# EAGLE design Ethernet Shield v2.0 (EAGLE 6.1)
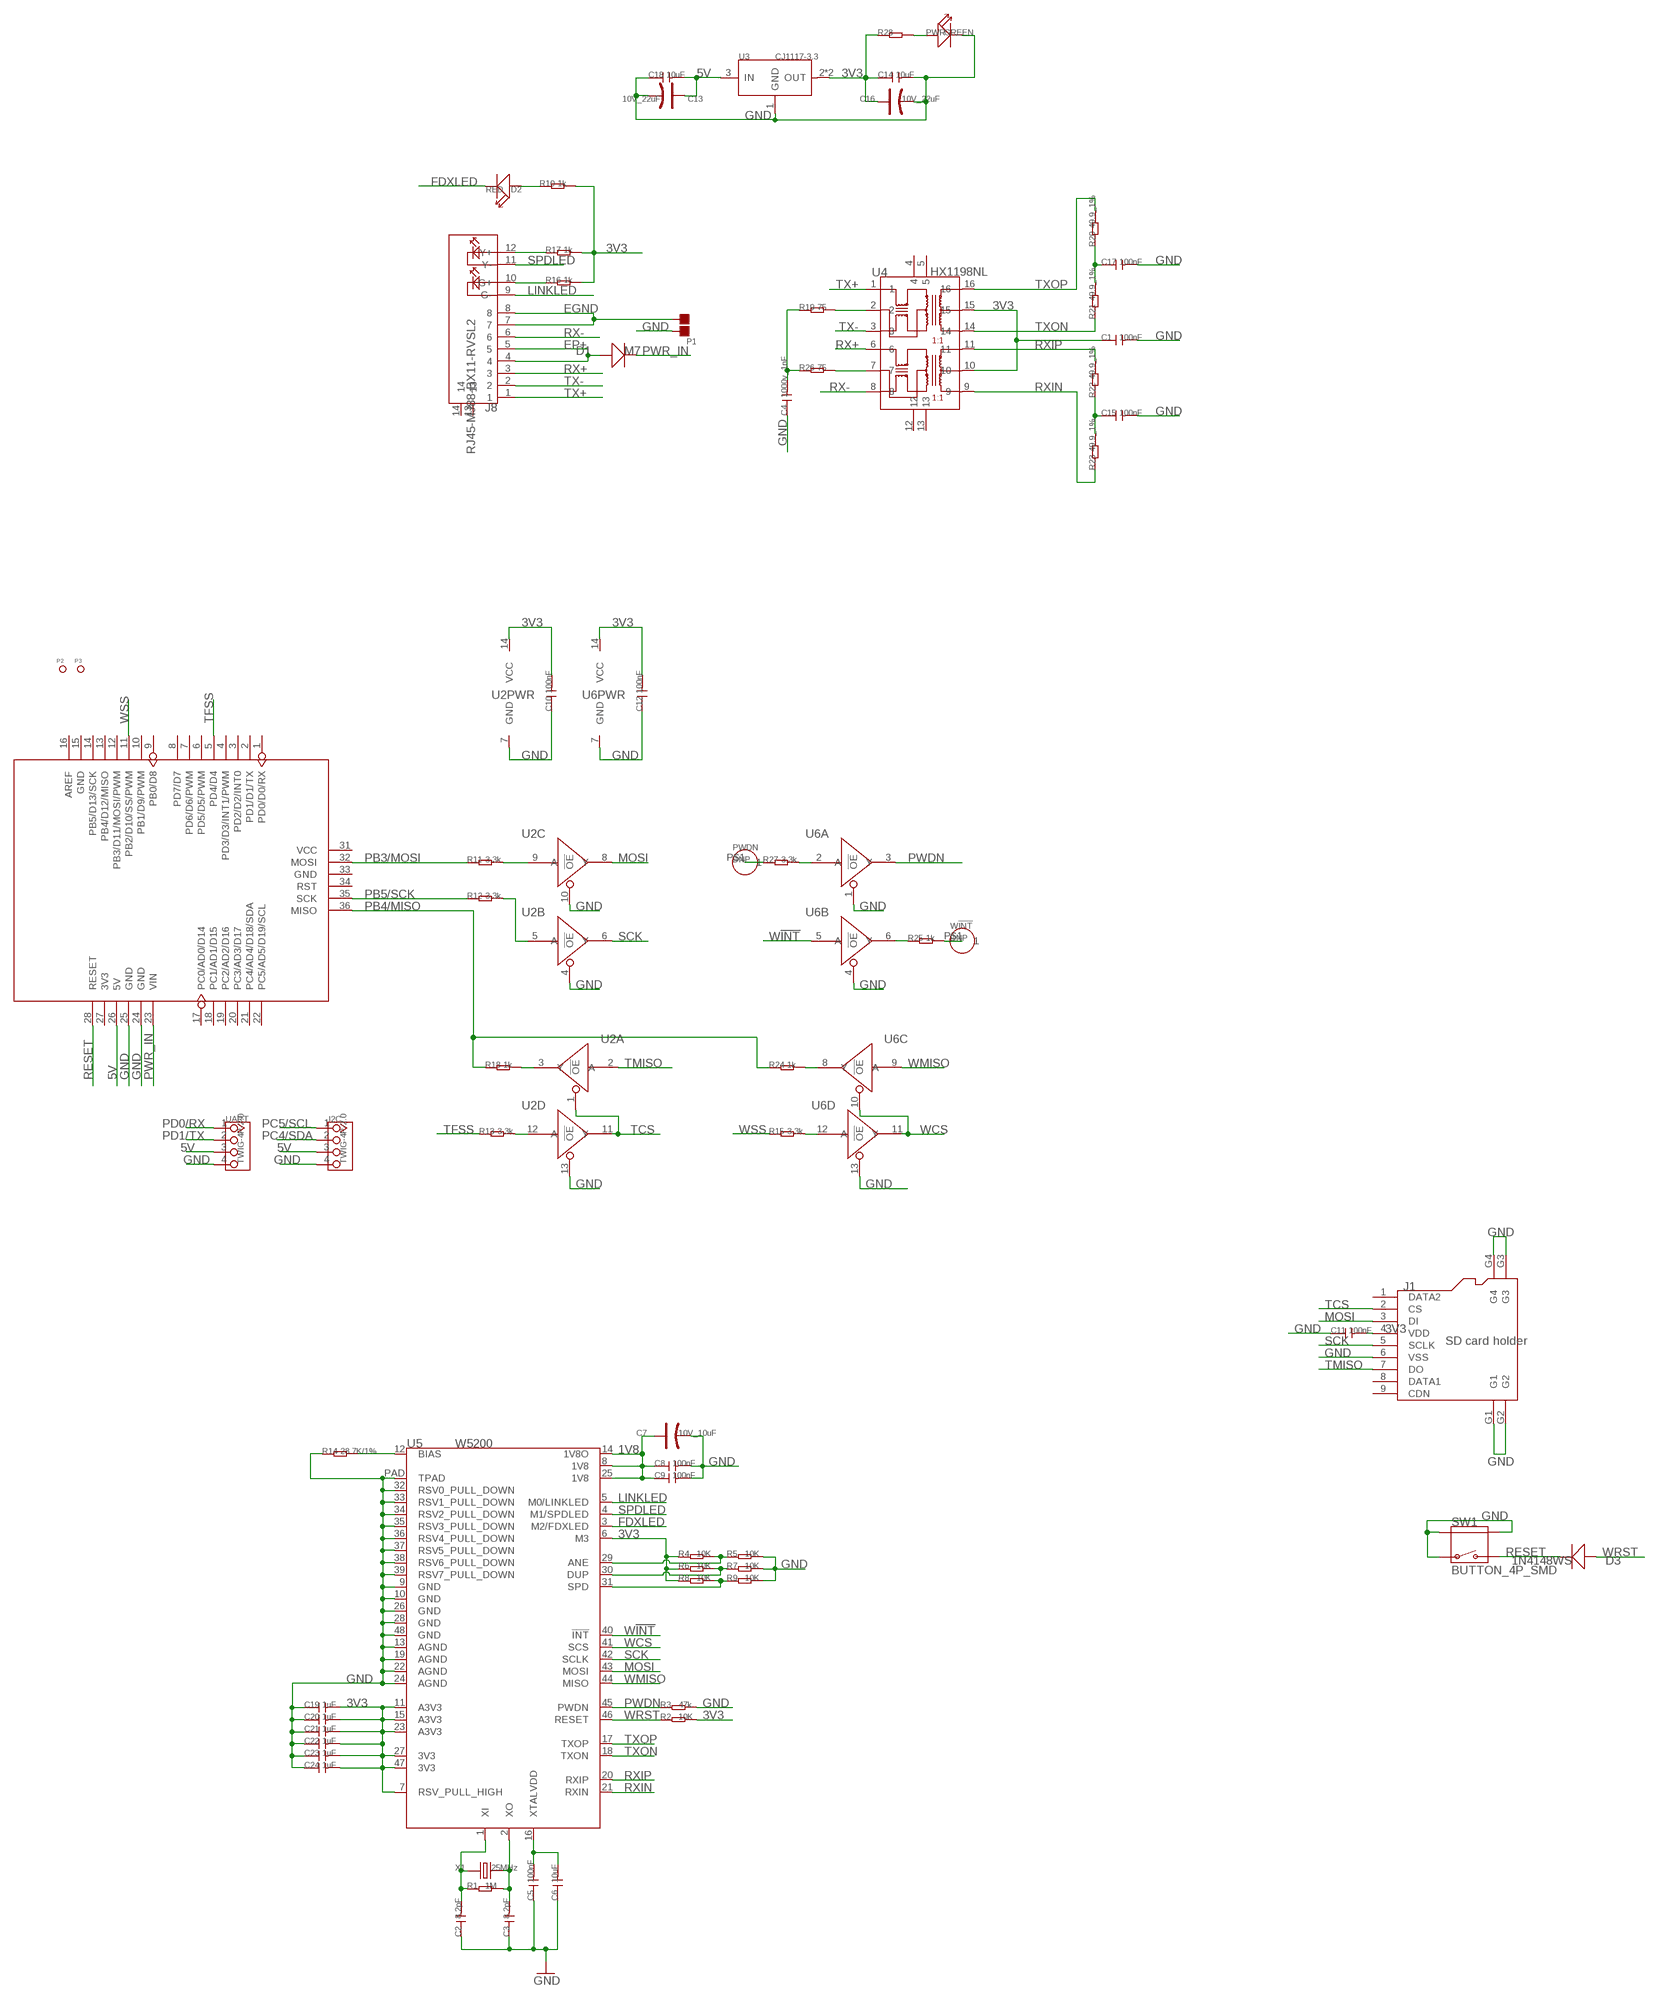
[diagram p0: schematic, sheet 1]

## Parts
C1  100nF  C-0603  [C0603]
C2  8.2pF  C-0603  [C0603]
C3  8.2pF  C-0603  [C0603]
C4  1000v_1nF  C-1206  [C1206]
C5  100nF  C-0603  [C0603]
C6  10uF  C-0805  [C0805]
C7  10V_10uF  CAP-AVX-A  [AVX-A]
C8  100nF  C-0603  [C0603]
C9  100nF  C-0603  [C0603]
C10  100nF  C-0603  [C0603]
C11  100nF  C-0603  [C0603]
C12  100nF  C-0603  [C0603]
C13  10V_22uF  CAP-AVX-B  [AVX-B]
C14  10uF  C-0805  [C0805]
C15  100nF  C-0603  [C0603]
C16  10V_22uF  CAP-AVX-B  [AVX-B]
C17  100nF  C-0603  [C0603]
C18  10uF  C-0805  [C0805]
C19  1uF  C-0805  [C0805]
C20  1uF  C-0805  [C0805]
C21  1uF  C-0805  [C0805]
C22  1uF  C-0805  [C0805]
C23  1uF  C-0805  [C0805]
C24  1uF  C-0805  [C0805]
D1  M7  D'SMA'  [D2010]
D2  RED  LED'0603'  [LED-0603]
D3  1N4148WS  D'0805'  [SOD323]
I2C  TWIG-4P-2.0  TWIG-4P-2.0-2.0  [4P-2.0]
J1  SD card holder  HOLDER-MICROSD-9P  [9P-SMD-W/-RING]
J8  RJ45-MJ88-BX11-RVSL2  [RJ45-MJ88-BX11-RVSL2]
P1  DNP  PAD-JUMPER-2P  [2P-SMD-1.78X1.27]
P2  PAD-MARK  [ROUND-MARK-1.0]
P3  PAD-MARK  [ROUND-MARK-1.0]
PWDN  DNP  HEADER-1P-35  [1P-65/35MIL]
PWR  GREEN  LED'0603'  [LED-0603]
R1  1M  R-0603  [R0603]
R2  10K  R-0603  [R0603]
R3  47k  R-0603  [R0603]
R4  10K  R-0603  [R0603]
R5  10K  R-0603  [R0603]
R6  10K  R-0603  [R0603]
R7  10K  R-0603  [R0603]
R8  10K  R-0603  [R0603]
R9  10K  R-0603  [R0603]
R10  1k  R-0603  [R0603]
R11  3.3k  R-0603  [R0603]
R12  3.3k  R-0603  [R0603]
R13  3.3k  R-0603  [R0603]
R14  28.7K/1%  R-0603  [R0603]
R15  3.3k  R-0603  [R0603]
R16  1k  R-0603  [R0603]
R17  1k  R-0603  [R0603]
R18  1k  R-0603  [R0603]
R19  75  R-0603  [R0603]
R20  49.9_1%  R-0603  [R0603]
R21  49.9_1%  R-0603  [R0603]
R22  49.9_1%  R-0603  [R0603]
R23  49.9_1%  R-0603  [R0603]
R24  1k  R-0603  [R0603]
R25  1k  R-0603  [R0603]
R26  75  R-0603  [R0603]
R27  3.3k  R-0603  [R0603]
R28  R-0603  [R0603]
SW1  BUTTON_4P_SMD  [4P-SMD-7X3.5X3.5]
U1  ARDUINO  [ARDUINO]
U2  74VHC125PW  [TSSOP14]
U3  CJ1117-3.3  LD1117S  [SOT-223]
U4  HX1198NL  [SOIC16-9.53]
U5  W5200  [QFN48]
U6  74VHC125PW  [TSSOP14]
UART  TWIG-4P-2.0  TWIG-4P-2.0-2.0  [4P-2.0]
W!INT  DNP  HEADER-1P-35  [1P-65/35MIL]
X1  25MHz  CRYSTAL'5032'  [2P-SMD-5X3.2]

## Nets
1V8: C7.+ C8.1 C9.1 U5.8(1V8) U5.14(1V8O) U5.25(1V8)
3V3: C1.1 C10.2 C11.2 C12.2 C14.1 C16.+ C19.2 C20.2 C21.2 C22.2 C23.2 C24.2 J1.4(VDD) R2.2 R4.1 R6.1 R8.1 R10.2 R16.2 R17.2 R28.1 U2.14(PWR:VCC) U3.2(OUT) U3.TER(OUT) U4.10 U4.15 U5.6(M3) U5.7(RSV_PULL_HIGH) U5.11(A3V3) U5.15(A3V3) U5.23(A3V3) U5.27(3V3) U5.47(3V3) U6.14(PWR:VCC)
5V [usbvcc]: C13.+ C18.2 I2C.3 U1.26(5V) U3.3(IN) UART.3
EGND [power]: J8.7 J8.8 P1.1
EP+: D1.+ J8.4 J8.5
FDXLED: D2.- U5.3(M2/FDXLED)
GND: C1.2 C2.1 C3.1 C4.1 C5.1 C6.1 C7.- C8.2 C9.2 C10.1 C11.1 C12.1 C13.- C14.2 C15.2 C16.- C17.2 C18.1 C19.1 C20.1 C21.1 C22.1 C23.1 C24.1 I2C.4 J1.6(VSS) J1.G1 J1.G2 J1.G3 J1.G4 P1.2 PWR.- R3.2 R5.2 R7.2 R9.2 R14.1 SW1.1 SW1.S1 SW1.S2 U1.24(GND) U1.25(GND) U2.4(B:!OE) U2.7(PWR:GND) U2.10(C:!OE) U2.13(D:!OE) U3.1(GND) U5.9(GND) U5.10(GND) U5.13(AGND) U5.19(AGND) U5.22(AGND) U5.24(AGND) U5.26(GND) U5.28(GND) U5.32(RSV0_PULL_DOWN) U5.33(RSV1_PULL_DOWN) U5.34(RSV2_PULL_DOWN) U5.35(RSV3_PULL_DOWN) U5.36(RSV4_PULL_DOWN) U5.37(RSV5_PULL_DOWN) U5.38(RSV6_PULL_DOWN) U5.39(RSV7_PULL_DOWN) U5.48(GND) U5.PAD(TPAD) U6.1(A:!OE) U6.4(B:!OE) U6.7(PWR:GND) U6.13(D:!OE) UART.4
LINKLED: J8.9(G-) U5.5(M0/LINKLED)
MOSI: J1.3(DI) U2.8(C:Y) U5.43(MOSI)
N$1: C2.2 R1.1 U5.1(XI) X1.1
N$2: C3.2 R1.2 U5.2(XO) X1.2
N$3: R4.2 R5.1 U5.29(ANE)
N$4: R6.2 R7.1 U5.30(DUP)
N$5: R8.2 R9.1 U5.31(SPD)
N$6: D2.+ R10.1
N$7: R12.2 U2.5(B:A)
N$8: R11.2 U2.9(C:A)
N$9: R13.2 U2.12(D:A)
N$10: R15.2 U6.12(D:A)
N$11: R26.2 U4.7
N$12: R19.2 U4.2
N$13: C4.2 R19.1 R26.1
N$14: R18.2 U2.3(A:Y)
N$15: C15.1 R22.1 R23.2
N$16: C17.1 R20.1 R21.2
N$17: R24.2 U6.8(C:Y)
N$18: J8.12(Y+) R17.1
N$19: J8.10(G+) R16.1
N$20: R25.1 U6.6(B:Y)
N$21: R25.2 W!INT.P$1
N$22: C5.2 C6.2 U5.16(XTALVDD)
N$23: R14.2 U5.12(BIAS)
N$24: R27.2 U6.2(A:A)
N$25: PWDN.P$1 R27.1
N$26: PWR.+ R28.2
PB3/MOSI: R11.1 U1.32(MOSI)
PB4/MISO: R18.1 R24.1 U1.36(MISO)
PB5/SCK: R12.1 U1.35(SCK)
PC4/SDA: I2C.2
PC5/SCL: I2C.1
PD0/RX: UART.1
PD1/TX: UART.2
PWDN: R3.1 U5.45(PWDN) U6.3(A:Y)
PWR_IN: D1.- U1.23(VIN)
RESET: D3.- SW1.2 U1.28(RESET)
RX+: J8.3 U4.6
RX-: J8.6 U4.8
RXIN: R23.1 U4.9 U5.21(RXIN)
RXIP: R22.2 U4.11 U5.20(RXIP)
SCK: J1.5(SCLK) U2.6(B:Y) U5.42(SCLK)
SPDLED: J8.11(Y-) U5.4(M1/SPDLED)
TCS: J1.2(CS) U2.1(A:!OE) U2.11(D:Y)
TFSS: R13.1 U1.5(PD4/D4)
TMISO: J1.7(DO) U2.2(A:A)
TX+: J8.1 U4.1
TX-: J8.2 U4.3
TXON: R21.1 U4.14 U5.18(TXON)
TXOP: R20.2 U4.16 U5.17(TXOP)
W!INT: U5.40(!INT) U6.5(B:A)
WCS: U5.41(SCS) U6.10(C:!OE) U6.11(D:Y)
WMISO: U5.44(MISO) U6.9(C:A)
WRST: D3.+ R2.1 U5.46(RESET)
WSS: R15.1 U1.11(PB2/D10/SS/PWM)
Unconnected: J1.1(DATA2) J1.8(DATA1) J1.9(CDN) J8.13 J8.14 U1.1(PD0/D0/RX) U1.2(PD1/D1/TX) U1.3(PD2/D2/INT0) U1.4(PD3/D3/INT1/PWM) U1.6(PD5/D5/PWM) U1.7(PD6/D6/PWM) U1.8(PD7/D7) U1.9(PB0/D8) U1.10(PB1/D9/PWM) U1.12(PB3/D11/MOSI/PWM) U1.13(PB4/D12/MISO) U1.14(PB5/D13/SCK) U1.15(GND) U1.16(AREF) U1.17(PC0/AD0/D14) U1.18(PC1/AD1/D15) U1.19(PC2/AD2/D16) U1.20(PC3/AD3/D17) U1.21(PC4/AD4/D18/SDA) U1.22(PC5/AD5/D19/SCL) U1.27(3V3) U1.31(VCC) U1.33(GND) U1.34(RST) U4.4 U4.5 U4.12 U4.13

## Library data of the parts
C1-C6 C8-C12 C14 C15 C17-C24 = Discrete:C*: Ceramic Capacitors
C7 C13 C16 = Discrete:CAP*: Electrolytic Capacitors,Tantalum Capacitors and Super Capacitors
D1 D3 = Discrete:D*
D2 PWR = Discrete:LED*
I2C UART = Connector:TWIG-4P-2.0
J1 = Connector:HOLDER-MICROSD-9P
J8 = Connector:RJ45-MJ88-BX11-RVSL2: Modular Jack 8P8C,R/A,With LED
P1 = Discrete:PAD-JUMPER-2P; PARTNO: DNP
P2 P3 = Discrete:PAD-MARK; PARTNO: DNP
PWDN W!INT = Connector:HEADER-1P
R1-R28 = Discrete:R*
SW1 = For_Test_Albert_v6:BUTTON_4P_SMD: TS-1188E http://www.best-dz.com/?thread-374-2.html
U1 = moudle:ARDUINO
U2 U6 = IC:74V*125: Quad Buffer/Line Driver;3-state
U3 = IC:LD1117: Low Drop Fixed And Adjustable Positive Voltage Regulators http://www.datasheetcatalog.org/datasheet/SGSThomsonMicroelectronics/mXuqtqv.pdf
U4 = IC:HX1198NL: 10/100BASE-T Single Port Surface Mount Magnetics With Various Turns Ratios
U5 = For_Test_Albert_v6:W5200
X1 = Discrete:CRYSTAL*: CRYSTAL

## Net classes
0 default: width 0.203 mm, drill 0.305 mm, clearance 0.152 mm
3 usbvcc: width 0.203 mm, drill 0.305 mm, clearance 0.203 mm

## Board
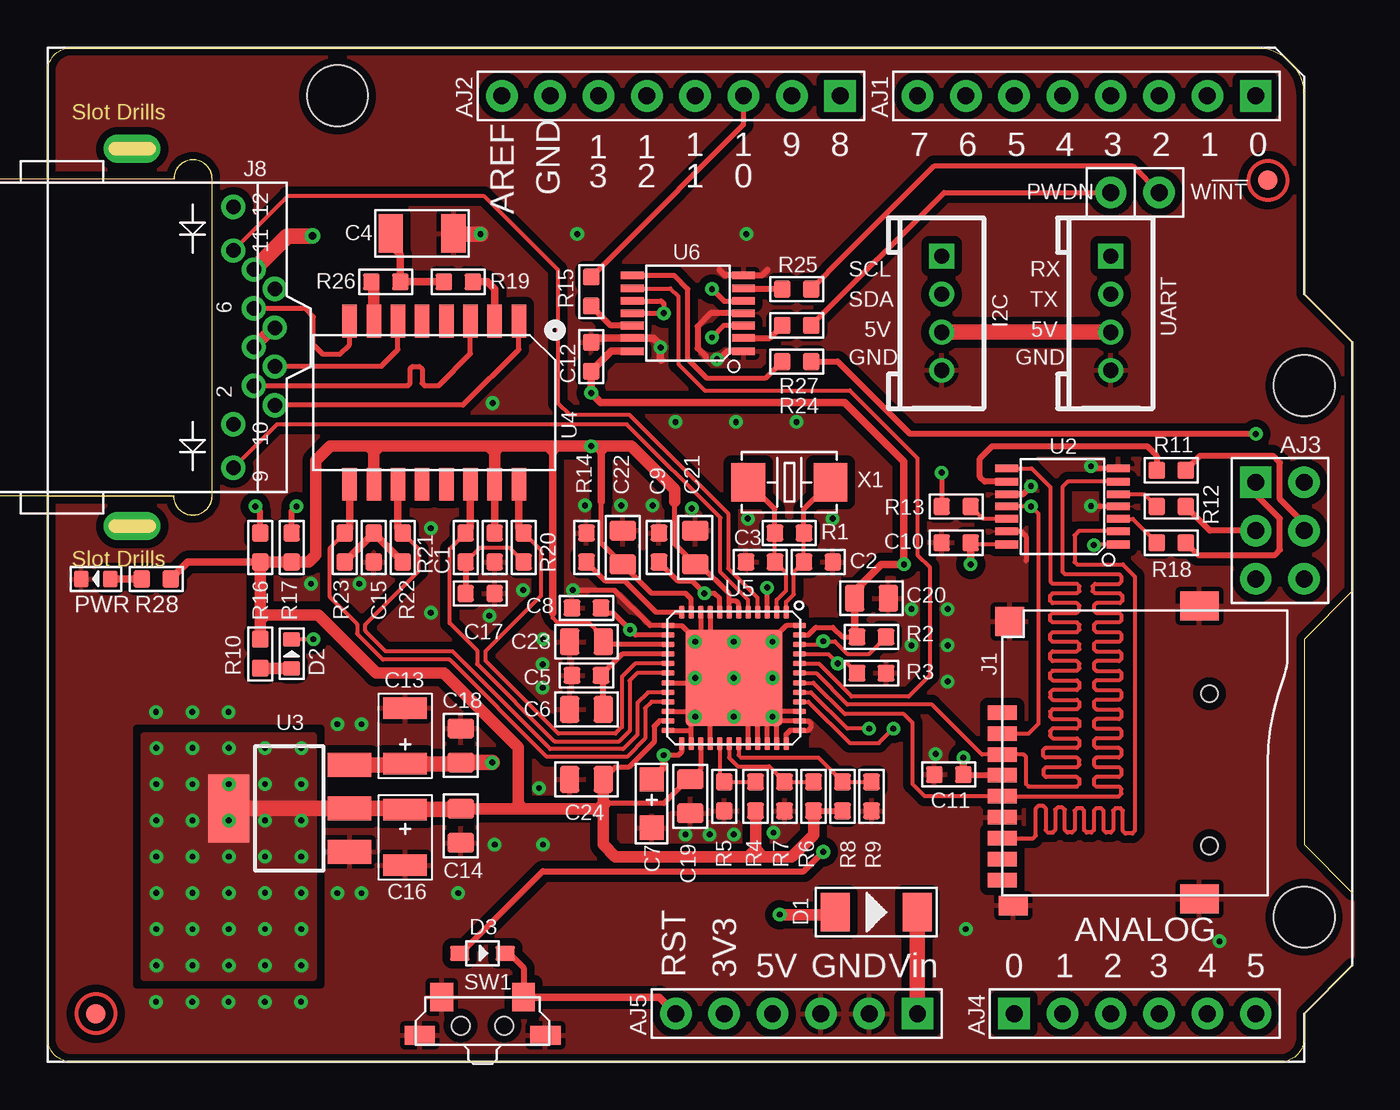
[diagram p1: board, top side]
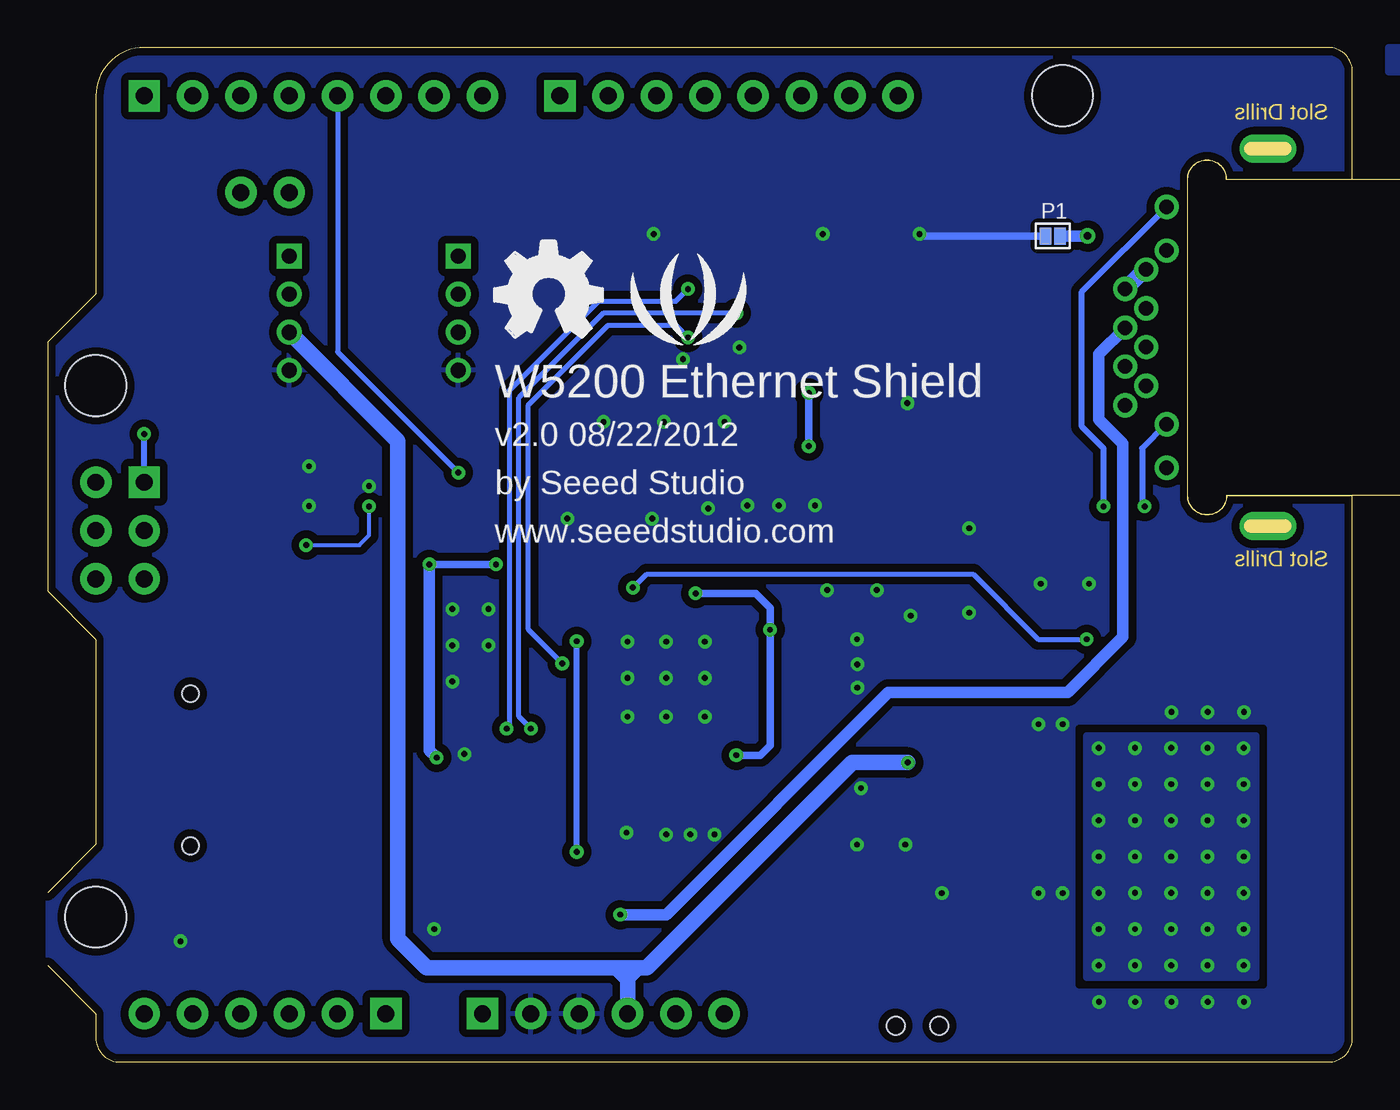
[diagram p2: board, bottom side, seen from below]

Size 68.58 x 53.34 mm. Coordinates in mm from the lower left corner, seen from the top.
Outline: 68.58,8.89 66.04,11.43 66.04,22.23 68.58,24.77 68.58,37.85 66.04,40.39 66.04,50.8 arc90 63.5,53.34 1.27,53.34 arc90 0,52.07 0,46.43 6.63,46.43 6.63,46.45 arc-89 7.63,47.44 7.66,47.44 arc-90 8.66,46.44 8.66,29.76 arc-90 7.66,28.76 7.61,28.76 arc-90 6.61,29.76 6.61,29.77 0,29.77 0,1.27 arc90 1.27,0 64.77,0 arc90 66.04,1.27 66.04,2.54 68.58,5.08
Copper layers (1*16): Top 0.035mm / dielectric 1.5mm / Bottom 0.035mm
Design rules: minimum track width 8mil, minimum drill 12mil, track to track 8mil, track to pad 8mil, pad to pad 8mil, via to via 8mil, smd to smd 0mil, copper to edge 10mil, drill to drill 8mil, minimum pad ring 10mil, minimum via ring 8mil, stop-mask expansion 4mil, vias tented up to drill 25mil, thermal gap 10mil
tRestrict: area -14.8,-27.3 to -11,-27.1; area 32.5,16.6 to 39.6,23.7

### Footprints (pad centres in the part's own frame; a part is rotated, then mirrored left to right if it is on the bottom)
C0603 = smd 0.889 x 0.889: 1 -0.762,0; 2 0.762,0
C1206 = smd 1.27 x 2.032: 1 -1.651,0; 2 1.651,0
C0805 = smd 1.016 x 1.397: 1 -0.889,0; 2 0.889,0
AVX-A = smd 1.27 x 1.27: + -1.27,0; - 1.27,0
AVX-B = smd 1.143 x 2.286: + -1.46,0; - 1.46,0
D2010 = smd 1.524 x 2.032: + -2.159,0; - 2.159,0
LED-0603 = smd 0.762 x 0.889: + -0.762,0; - 0.762,0
SOD323 = smd 1 x 0.8: + -1.2,0; - 1.2,0
4P-2.0 = drill 0.8 pad 1.27 square: 1 -3,0 | drill 0.8 pad 1.27: 2 -1,0; 3 1,0; 4 3,0
9P-SMD-W/-RING = smd 1.524 x 0.762: 1 0,4.4; 2 0,3.3; 3 0,2.2; 4 0,1.1; 5 0,0; 6 0,-1.1; 7 0,-2.2; 8 0,-3.3; 9 0,-4.4 | smd 1.524 x 1.016: G1 0.6,-5.746 | smd 2.032 x 1.524: G2 10.373,-5.4; G3 10.373,10 | smd 1.524 x 1.524: G4 0.392,9.181 | hole 0.889: 10.9,-2.6; 10.9,5.4
RJ45-MJ88-BX11-RVSL2 = drill 0.762 pad 1.27: 1 3.57,7.5; 2 2.55,6.4; 3 1.53,7.5; 4 0.51,6.4; 5 -0.51,7.5; 6 -1.53,6.4; 7 -2.55,7.5; 8 -3.57,6.4; 9 6.86,5.32; 10 4.57,5.32; 11 -4.57,5.32; 12 -6.86,5.32 | drill 0.6 pad 1.5 long: 13 -9.92,0; 14 9.92,0
2P-SMD-1.78X1.27 = smd 0.889 x 0.61: 1 0,0.381; 2 0,-0.381
ROUND-MARK-1.0 = smd 1.016 x 1.016: P$1 0,0
1P-65/35MIL = drill 0.889 pad 1.651: P$1 0,0
R0603 = smd 0.889 x 0.889: 1 -0.762,0; 2 0.762,0
4P-SMD-7X3.5X3.5 = smd 1.2 x 1.5: 1 -2.15,1.5; 2 2.15,1.5 | smd 1.6 x 1: S1 -3.3,-0.5; S2 3.3,-0.5 | hole 0.95: -1.15,0; 1.15,0
ARDUINO = drill 0.889 pad 1.651 square: 1 63.5,50.8; 9 41.656,50.8; 17 50.8,2.54; 23 45.72,2.54; 36 63.5,30.48 | drill 0.889 pad 1.651: 2 60.96,50.8; 3 58.42,50.8; 4 55.88,50.8; 5 53.34,50.8; 6 50.8,50.8; 7 48.26,50.8; 8 45.72,50.8; 10 39.116,50.8; 11 36.576,50.8; 12 34.036,50.8; 13 31.496,50.8; 14 28.956,50.8; 15 26.416,50.8; 16 23.876,50.8; 18 53.34,2.54; 19 55.88,2.54; 20 58.42,2.54; 21 60.96,2.54; 22 63.5,2.54; 24 43.18,2.54; 25 40.64,2.54; 26 38.1,2.54; 27 35.56,2.54; 28 33.02,2.54; 31 66.04,30.48; 32 66.04,27.94; 33 66.04,25.4; 34 63.5,25.4; 35 63.5,27.94 | hole 3.2: 15.24,50.8; 66.04,35.56; 66.04,7.62
TSSOP14 = smd 0.4 x 1.2: 1 -2,-2.925; 2 -1.3,-2.925; 3 -0.65,-2.925; 4 0,-2.925; 5 0.65,-2.925; 6 1.3,-2.925; 7 2,-2.925; 8 2,2.925; 9 1.3,2.925; 10 0.65,2.925; 11 0,2.925; 12 -0.65,2.925; 13 -1.3,2.925; 14 -2,2.925
SOT-223 = smd 1.27 x 2.286: 1 -2.286,-3.175; 2 0,-3.175; 3 2.286,-3.175 | smd 3.556 x 2.159: TER 0,3.175
SOIC16-9.53 = smd 0.762 x 1.714: 1 -4.445,-4.286; 2 -3.175,-4.286; 3 -1.905,-4.286; 4 -0.635,-4.286; 5 0.635,-4.286; 6 1.905,-4.286; 7 3.175,-4.286; 8 4.445,-4.286; 9 4.445,4.286; 10 3.175,4.286; 11 1.905,4.286; 12 0.635,4.286; 13 -0.635,4.286; 14 -1.905,4.286; 15 -3.175,4.286; 16 -4.445,4.286
QFN48 = smd 0.3 x 0.7: 1 -2.75,-3.45; 2 -2.25,-3.45; 3 -1.75,-3.45; 4 -1.25,-3.45; 5 -0.75,-3.45; 6 -0.25,-3.45; 7 0.25,-3.45; 8 0.75,-3.45; 9 1.25,-3.45; 10 1.75,-3.45; 11 2.25,-3.45; 12 2.75,-3.45; 25 2.75,3.45; 26 2.25,3.45; 27 1.75,3.45; 28 1.25,3.45; 29 0.75,3.45; 30 0.25,3.45; 31 -0.25,3.45; 32 -0.75,3.45; 33 -1.25,3.45; 34 -1.75,3.45; 35 -2.25,3.45; 36 -2.75,3.45 | smd 0.7 x 0.3: 13 3.45,-2.75; 14 3.45,-2.25; 15 3.45,-1.75; 16 3.45,-1.25; 17 3.45,-0.75; 18 3.45,-0.25; 19 3.45,0.25; 20 3.45,0.75; 21 3.45,1.25; 22 3.45,1.75; 23 3.45,2.25; 24 3.45,2.75; 37 -3.45,2.75; 38 -3.45,2.25; 39 -3.45,1.75; 40 -3.45,1.25; 41 -3.45,0.75; 42 -3.45,0.25; 43 -3.45,-0.25; 44 -3.45,-0.75; 45 -3.45,-1.25; 46 -3.45,-1.75; 47 -3.45,-2.25; 48 -3.45,-2.75 | smd 5.1 x 5.1: PAD 0,0
2P-SMD-5X3.2 = smd 1.778 x 2.032: 1 -2.159,0; 2 2.159,0

### Placement (x,y rotation side)
C1  23.5,27.05 270 top
C2  40.51,26.29 180 top
C3  37.47,26.29 0 top
C4  19.68,43.56 180 top
C5  28.32,20.32 0 top
C6  28.32,18.54 0 top
C7  31.75,13.59 270 top
C8  28.32,23.88 180 top
C9  32.13,27.05 90 top
C10  47.75,27.3 0 top
C11  47.37,15.11 0 top
C12  28.57,37.08 270 top
C13  18.8,17.14 90 top
C14  21.72,12.42 270 top
C15  17.14,27.05 270 top
C16  18.8,11.81 270 top
C17  22.73,24.64 0 top
C18  21.72,16.64 270 top
C19  33.78,13.97 90 top
C20  43.31,24.38 180 top
C21  34.04,27.05 270 top
C22  30.23,27.05 270 top
C23  28.32,22.1 0 top
C24  28.32,14.86 0 top
D1  43.56,7.87 0 top
D2  12.83,21.46 90 top
D3  22.86,5.71 0 top
I2C  46.99,39.37 270 top
J1  50.16,13.97 0 top
J8  4.45,38.1 270 top
P1  15.75,43.43 270 bottom
P2  2.54,2.54 0 top
P3  64.14,46.35 0 top
PWDN  55.88,45.72 0 top
PWR  2.54,25.4 180 top
R1  38.99,27.81 180 top
R2  43.31,22.35 180 top
R3  43.31,20.45 0 top
R4  37.21,13.97 90 top
R5  35.56,13.97 270 top
R6  40.26,13.97 90 top
R7  38.73,13.97 270 top
R8  41.78,13.97 90 top
R9  43.31,13.97 270 top
R10  11.18,21.46 90 top
R11  59.05,31.11 180 top
R12  59.05,29.21 180 top
R13  47.75,29.21 0 top
R14  28.32,27.05 270 top
R15  28.57,40.51 270 top
R16  11.18,27.05 270 top
R17  12.83,27.05 270 top
R18  59.05,27.3 180 top
R19  21.59,41.02 0 top
R20  25.02,27.05 90 top
R21  21.97,27.05 270 top
R22  18.67,27.05 90 top
R23  15.62,27.05 270 top
R24  39.37,36.83 180 top
R25  39.37,40.64 0 top
R26  17.78,41.02 180 top
R27  39.37,38.73 180 top
R28  5.71,25.4 180 top
SW1  22.86,1.91 0 top
U1  0,0 0 top
U2  53.34,29.21 90 top
U3  12.7,13.34 90 top
U4  20.32,34.67 180 top
U5  36.07,20.19 180 top
U6  33.66,39.37 90 top
U$1  [LOGO_SILK]  34.92,39.37 0 bottom
U$2  [OSHW_FILLX200_NOTEXT]  45.09,38.1 0 bottom
UART  55.88,39.37 270 top
W!INT  58.42,45.72 0 top
X1  38.99,30.48 180 top

### Tracks (layer width: path | path; a pad name or v marks a point on that pad's centre or on a via)
1V8  (via drill 0.3 pad 0.64)
  Top 0.254: U5.25 33.32,16.3 33.15,16.13 v32.38,16.13 | C8.1 29.21,23.75 29.21,23.62 29.72,23.62 v30.61,22.73 30.9,22.44 U5.14 | U5.8 35.32,24.37 35.05,24.64 v34.52,24.64 34.52,24.66 33.91,25.27 33.15,25.27 C9.1
  Top 0.406: C7.+ 32.38,15.49 v32.38,16.13
  Bottom 0.406: v32.38,16.13 31.11,16.13 30.61,16.64 v30.61,22.73 30.61,23.88 31.37,24.64 v34.52,24.64
3V3  (via drill 0.3 pad 0.64)
  Top 0.203: C24.2 29.21,14.99 | U2.14 48.61,27.21 C10.2 | C23.2 29.21,22.35 28.45,23.11 26.8,23.11 26.54,23.37 26.54,23.62
  Top 0.254: 32.97,29.57 32.97,29.46 32.97,27.23 C21.2 34.29,26.16 35.82,24.63 35.82,24.23 | 29.11,29.46 29.11,27.28 C22.2 31.75,24.64 33.53,24.64 33.82,24.35 U5.11 | U5.27 34.32,15.39 C19.2 33.66,14.86 32.38,13.59 29.34,13.59 29.21,13.72 | U5.7 35.82,24.23 | 35.82,24.23 36.2,24.23 36.32,24.11 U5.6 | U5.15 29.36,21.94 C23.2 | U5.47 39.97,22.44 40.39,22.86 41.27,22.86 41.78,22.35 R2.2 | 23.27,32.31 23.29,32.31 23.37,32.38 | 29.34,13.4 29.53,13.59 29.34,13.78 29.34,13.84 29.21,13.97 | U5.23 32.17,17.94 31.88,17.65 31.88,16.83 30.54,15.49 29.84,15.49 C24.2
  Top 0.305: J1.4 48.18,15.07 C11.2 | R6.1 R8.1
  Top 0.406: U4.15 C1.1 | C11.2 v48.13,16 | U6.14 29.62,37.37 C12.2 v28.57,35.18 29.08,34.67 41.91,34.67 45.01,31.57 v45.01,26.16 43.81,26.16 42.42,24.77 C20.2 42.42,22.48 R2.2 | v48.51,26.16 C10.2 | 26.54,23.62 26.54,32 | 26.54,32.03 26.54,32.26 26.67,32.38 | 29.11,29.46 29.11,32.05 | 29.11,32.05 29.11,32.16 29.34,32.38 | 26.54,32 26.29,32.26 | 26.54,32 26.54,32.03 | 26.54,32.03 26.82,32.31 | 29.11,32.05 28.91,32.26 | 29.11,32.05 29.36,32.31 | R16.2 7.37,26.29 R28.1
  Top 0.61: U4.15 23.5,32.38 | 23.5,32.38 23.37,32.38 16.89,32.38 | 16.89,32.38 14.86,32.38 14.1,31.62 14.1,26.67 13.72,26.29 R17.2 R16.2 11.18,23.75 | U4.10 17.14,32.08 | 17.14,32.08 17.14,32.13 16.89,32.38 | R10.2 11.18,23.11 11.18,23.24 | 11.18,23.24 11.18,23.75 | 23.5,32.38 26.67,32.38 v28.57,32.38 29.34,32.38 30.69,32.38 32.97,30.1 32.97,29.46 | 11.43,23.5 14.22,23.5 17.27,20.45 20.83,20.45 24.73,16.55 24.73,13.58 | 11.43,23.5 11.18,23.75 | 29.21,13.21 29.21,13.59 | 29.21,13.59 29.21,13.72 29.21,13.97 C24.2 | 29.21,13.21 29.21,12.95 | 29.21,12.95 29.21,11.43 29.84,10.79 36.83,10.79 | 36.83,10.79 37.21,10.79 | 37.21,10.79 37.59,10.79 | 37.59,10.79 39.12,10.79 40.26,11.94 R6.1 | R4.1 37.21,10.79 | 36.83,10.79 37.21,11.18 37.59,10.79 | C14.1 24.89,13.31 | 24.89,13.31 28.85,13.31 | 28.93,13.31 29.11,13.31 29.21,13.21 | 24.73,13.55 24.73,13.47 24.89,13.31 | 28.85,13.31 28.93,13.31 | 28.93,13.31 29.21,13.59 | 28.85,13.31 29.21,12.95 | 24.73,13.58 24.73,13.55 | 24.73,13.55 24.51,13.34 | 24.73,13.58 24.94,13.36 | 17.14,32.08 17.32,32.26 | 23.27,32.31 23.5,32.08 23.72,32.31 | 11.18,23.24 11.43,23.5
  Top 0.813: C14.1 21.68,13.27 C16.+ 18.73,13.34 U3.2 U3.TER
  Bottom 0.406: v45.01,26.16 v48.51,26.16 | v28.57,32.38 v28.57,35.18
  Bottom 0.61: v48.13,16 48.51,16.38 v48.51,26.16
  other vias: 5.71,16.51 5.71,14.61 5.71,12.7 5.71,10.79 5.71,8.89 5.71,6.99 5.71,5.08 7.62,5.08 7.62,6.99 7.62,8.89 7.62,10.79 7.62,12.7 7.62,14.61 7.62,16.51 9.53,16.51 9.53,14.61 11.43,14.61 11.43,16.51 13.34,16.51 13.34,14.61 13.34,12.7 11.43,12.7 9.53,12.7 9.53,10.79 11.43,10.79 13.34,10.79 13.34,8.89 11.43,8.89 9.53,8.89 9.53,6.99 11.43,6.99 13.34,6.99 13.34,5.08 11.43,5.08 9.53,5.08
  pour Top (isolate 0.406, no thermals): 13.97,17.14 5.08,17.14 5.08,4.45 13.97,4.45
  pour Top (isolate 0.406, no thermals): 13.97,17.14 5.08,17.14 5.08,4.45 13.97,4.45
  pour Bottom (isolate 0.406, no thermals): 13.97,17.14 5.08,17.14 5.08,4.45 13.97,4.45
5V  (via drill 0.3 pad 0.64)
  Top 0.813: I2C.3 UART.3 | U3.3 18.73,15.62 C13.+ 21.65,15.68 C18.2 v23.37,15.75
  Bottom 0.813: v23.37,15.75 26.29,15.75 37.08,4.95 38.1,4.95 | 38.1,4.38 U1.26 | 38.1,4.95 48.64,4.95 50.16,6.48 50.16,32.66 UART.3 | 38.1,4.45 38.1,4.95 | 38.1,4.38 38.1,4.45 | 38.1,4.45 37.72,4.83 | 38.1,4.38 38.61,4.89
EGND  (via drill 0.38 pad 0.81)
  Top 0.813: v13.92,43.43 12.61,43.43 J8.8
  Bottom 0.61: P1.1 v13.92,43.43
  Bottom 0.813: J8.8 10.93,41.67 J8.7
EP+  (via drill 0.3 pad 0.64)
  Top 0.61: v38.48,7.75 41.27,7.75 D1.+ | J8.5 11.87,38.61 J8.4
  Bottom 0.61: J8.5 13.34,37.21 13.34,33.78 12.06,32.51 12.06,22.34 14.97,19.43 24.38,19.43 36.07,7.75 v38.48,7.75
FDXLED  (via drill 0.3 pad 0.64)
  Top 0.203: v13.97,22.23 D2.-
  Top 0.254: U5.3 v37.82,24.94
  Bottom 0.254: v37.82,24.94 37.8,24.94 37.08,25.65 19.94,25.65 16.51,22.23 v13.97,22.23
GND  (via drill 0.3 pad 0.64)
  Top 0.254: U5.26 33.82,17.48 | 33.82,17.48 33.82,18.41 | U5.19 34.92,19.94 | U5.22 34.26,18.44 | U5.28 34.82,17.89 | 34.31,21.97 33.34,22.94 U5.13 31.67,22.94 29.79,24.82 v27.61,24.82 | U5.10 34.32,21.97 | U5.9 34.82,22.33 | U5.48 38.82,22.94 38.1,22.23 | U5.24 33.79,17.44 33.82,17.48 | U5.32 36.82,18.05 | U5.34 37.82,17.88 | U5.33 37.32,18.01 | U5.35 38.32,17.94 | U5.36 38.82,17.23 39.03,17.44 U5.37 39.98,17.44 40.13,17.59 40.13,17.78 39.97,17.94 U5.38 38.04,17.94 | U2.13 51.15,27.91 51.44,27.62 51.44,26.35 | U2.7 54.95,31.21 v54.84,31.32 | U2.4 54.86,29.21 v54.84,29.23 | U5.39 38.38,18.44
  Top 0.305: U2.10 51.27,29.86 v51.69,30.28 | 34.92,20.32 33.82,19.21 33.82,18.41 34.29,18.41 | 34.92,20.32 34.92,19.94 | 34.92,19.94 35.82,19.94 U5.PAD 36.7,20.19 38.1,21.59 38.1,22.23 | 34.92,19.68 34.92,19.94 | 34.26,18.44 34.29,18.41 | 34.82,17.89 34.29,18.41 | 37.8,18.19 38.04,17.94 38.04,18.1 v38.1,18.16 | 34.49,21.79 34.31,21.97 34.32,21.97 | 34.49,21.79 34.92,21.36 34.92,20.32 | 34.92,22.23 34.82,22.33 34.82,22.12 34.49,21.79 | 36.7,18.16 36.82,18.05 37.98,18.05 v38.1,18.16 | 37.82,17.88 v38.1,18.16 | 37.32,18.01 37.34,18.03 37.97,18.03 v38.1,18.16 | 38.32,17.94 v38.1,18.16 | 38.38,18.44 v38.1,18.16 | U6.4 34.86,39.37 34.16,38.67 34.16,37.53 34.61,37.08 | 35.36,37.08 v35.18,36.96 | U6.1 35.72,37.37 35.31,36.96 | 37.85,41.66 37.56,41.37 U6.7 35.59,41.37 35.31,41.66
  Top 0.406: C12.1 28.8,38.07 U6.13 31.84,38.07 32.19,37.72 32.19,36.96 32.26,36.89
  Top 0.813: v22.76,43.54 21.36,43.54 C4.1
  Bottom 0.406: P1.2 22.66,43.43 v22.76,43.54
  other vias: 46.67,16.19 45.4,21.91 45.4,23.81 33.86,29.11 31.8,29.26 30.15,29.26 33.01,33.66 36.18,33.66 39.36,33.66 41.26,28.57 47.31,23.81 47.31,21.91 33.53,11.96 34.8,11.96 36.07,11.96 38.15,12.06 28.24,29.26 26.04,22.23 26.02,20.9 26.02,19.68 23.22,23.47 24.99,24.82 25.83,14.4 36.8,28.57 16.38,25.15 13.84,25.15 20.14,23.62 36.07,20.19 38.1,20.19 34.04,20.19 34.04,22.1 36.07,22.1 38.1,22.1 36.07,18.16 34.04,18.16 27.84,43.54 36.73,43.54 32.22,37.57 15.23,17.77 16.5,17.77 16.5,8.88 15.23,8.88 21.58,8.88 23.5,11.43 26.04,11.43 7.61,18.4 9.51,18.4 5.7,3.16 13.32,3.16 48.26,6.99 61.59,6.35 20.14,28.07 23.39,34.65 47.31,20 7.61,3.16 9.51,3.16 11.42,3.16 5.7,18.4
  pour Bottom: -3.17,53.34 -1.91,53.34 -1.91,52.07 -3.17,52.07
  pour Top (isolate 0.406, rank 6): 0,53.34 64.52,53.34 66.04,51.82 66.04,40.39 68.58,37.85 68.58,5.08 66.04,2.54 66.04,0 0,0
  pour Bottom (isolate 0.406, rank 6): 0,53.34 64.52,53.34 66.04,51.82 66.04,40.39 68.58,37.85 68.58,5.08 66.04,2.54 66.04,0 0,0
LINKLED
  Top 0.203: U5.5 36.82,24.29 35.36,25.76 35.36,28.62 30.45,33.53 12.05,33.53 J8.9
MOSI
  Top 0.203: U2.8 51.72,31.21 52.7,30.23 52.7,25.27 52.83,25.15 54.1,25.15 54.23,25.02 54.23,24.77 54.1,24.64 52.82,24.64 52.69,24.51 52.69,24.26 52.82,24.13 54.1,24.13 54.23,24 54.23,23.75 54.1,23.62 52.82,23.62 52.69,23.5 52.69,23.24 52.82,23.11 54.1,23.11 54.23,22.99 54.23,22.73 54.1,22.61 52.82,22.61 52.69,22.48 52.69,22.23 52.82,22.1 54.1,22.1 54.23,21.97 54.23,21.72 54.1,21.59 52.82,21.59 52.69,21.46 52.69,21.21 52.82,21.08 54.1,21.08 54.23,20.95 54.23,20.7 54.1,20.57 52.82,20.57 52.69,20.45 52.69,20.19 52.82,20.07 54.1,20.07 54.23,19.94 54.23,19.68 54.1,19.56 52.82,19.56 52.69,19.43 52.69,19.18 52.82,19.05 54.1,19.05 54.23,18.92 54.23,18.67 54.1,18.54 52.82,18.54 52.69,18.41 52.69,18.16 52.82,18.03 54.1,18.03 54.23,17.91 54.23,17.65 54.1,17.53 52.82,17.53 52.69,17.4 52.69,17.14 52.82,17.02 54.1,17.02 54.23,16.89 54.23,16.64 54.1,16.51 52.44,16.51 52.31,16.38 52.31,16.13 52.44,16 54.1,16 54.23,15.88 54.23,15.62 54.1,15.49 52.46,15.49 52.34,15.37 52.34,15.11 52.46,14.99 54.1,14.99 54.23,14.86 54.23,14.61 54.1,14.48 51.56,14.48 51.44,14.61 51.44,16.04 51.3,16.17 J1.3 49.11,16.17 46.48,18.8 42.04,18.8 40.39,20.44 U5.43
N$1
  Top 0.203: R1.1 C2.2 39.22,25.76 39.22,24.59 38.82,24.19 U5.1
  Top 0.254: R1.1 39.75,29.08 X1.1
N$2
  Top 0.203: R1.2 C3.2 38.81,25.7 38.81,24.79 38.32,24.3 U5.2
  Top 0.254: R1.2 38.23,29.08 X1.2
N$3
  Top 0.203: R4.2 R5.1 35.32,14.97 U5.29
N$4
  Top 0.203: R6.2 R7.1 37.92,15.54 36.27,15.54 35.82,16 U5.30
N$5
  Top 0.203: R9.1 R8.2 40.51,16 36.45,16 36.32,16.13 U5.31
N$6
  Top 0.61: R10.1 D2.+
N$7
  Top 0.203: U2.5 57.64,29.86 R12.2
N$8
  Top 0.305: U2.9 49.26,30.51 49,30.77 49,31.74 49.65,32.38 57.78,32.38 58.29,31.88 R11.2
N$9
  Top 0.203: U2.12 49.16,28.56 R13.2
N$10
  Top 0.305: U6.12 29.61,38.72 R15.2
N$11
  Top 0.61: U4.7 17.14,40.89 R26.2
N$12
  Top 0.406: U4.2 23.5,40.01 23.5,40.64 23.11,41.02 R19.2
N$13
  Top 0.406: C4.2 18.03,42.95 18.54,42.44 R26.1 R19.1
N$14
  Top 0.203: U2.3 57.04,28.56 R18.2
N$15
  Top 0.406: R23.2 C15.1 17.14,27.65 17.31,27.65 R22.1
N$16
  Top 0.203: R20.1 24.26,27.05 22.73,27.05 R21.2
  Top 0.305: R21.2 C17.1
N$17
  Top 0.254: R24.2 37.72,35.94 34.67,35.94 33.66,36.96 33.66,40.64 32.92,41.37 U6.8
N$18  (via drill 0.3 pad 0.64)
  Top 0.305: R17.1 12.83,28.96 v13.08,29.21
  Bottom 0.305: v13.08,29.21 13.08,32.26 14.22,33.4 14.22,40.5 J8.12
N$19  (via drill 0.3 pad 0.64)
  Top 0.305: R16.1 11.18,28.96 v10.92,29.21
  Bottom 0.305: J8.10 11.05,32.26 11.05,29.34 v10.92,29.21
N$20
  Top 0.305: U6.6 38.58,40.67 R25.1
N$21
  Top 0.254: R25.2 41.91,42.42 46.61,47.12 57.02,47.12 W!INT.P$1
N$22
  Top 0.254: U5.16 30.21,21.44 C5.2
  Top 0.305: C6.2 29.21,20.19 C5.2
N$23
  Top 0.254: U5.12 31.98,23.64 30.35,25.27 29.34,25.27 R14.2
N$24
  Top 0.305: U6.2 37.94,38.07 R27.2
N$25
  Top 0.254: R27.1 47.12,45.72 PWDN.P$1
N$26
  Top 0.406: PWR.+ R28.2
PB3/MOSI
  Top 0.305: U1.32 66.04,28.32 64.77,29.59 64.77,31.5 64.39,31.88 60.58,31.88 R11.1
PB4/MISO  (via drill 0.3 pad 0.64)
  Top 0.305: R18.1 60.45,26.67 64.52,26.67 64.77,26.92 64.77,28.57 63.5,29.84 U1.36 | R24.1 41.53,36.83 45.34,33.02 v63.5,33.02
  Bottom 0.305: U1.36 v63.5,33.02
PB5/SCK
  Top 0.305: U1.35 61.09,27.94 R12.1
PWDN  (via drill 0.3 pad 0.64)
  Top 0.203: U5.45 41.04,21.44 v41.53,20.95 42.04,20.95 R3.1
  Top 0.254: v34.92,38.1 35.56,38.73 36.56,38.73 U6.3
  Bottom 0.254: v34.92,38.1 35.56,38.73 39.12,38.73 43.31,34.54 43.31,22.73 v41.53,20.95
PWR_IN
  Top 0.813: U1.23 D1.-
RESET
  Top 0.305: D3.- 24.26,5.71 25.02,4.95 SW1.2
  Top 0.406: SW1.2 32.16,3.4 U1.28
RX+
  Top 0.254: U4.6 18.41,37.47 17.53,36.58 17.52,36.57 J8.3
RX-
  Top 0.254: J8.6 13.52,39.63 13.97,39.18 13.97,37.72 14.47,37.21 15.36,37.21 15.88,37.73 U4.8
RXIN
  Top 0.203: U5.21 31.74,18.94 31.41,18.61 31.41,17 30.45,16.05 26.24,16.05 21.13,21.16 17.62,21.16 16.27,22.52 16.27,23.02 14.83,24.46 14.83,27.03 R23.1
  Top 0.406: U4.9 15.88,28.07 R23.1
RXIP
  Top 0.203: U5.20 31.56,19.44 31,18.88 31,17.21 30.25,16.46 26.42,16.46 21.29,21.59 17.78,21.59 16.7,22.67 16.7,23 19.51,25.81 19.51,26.98 R22.2
  Top 0.406: U4.11 18.41,28.07 R22.2
SCK
  Top 0.203: U5.42 40.26,19.94 41.91,18.29 45.01,18.29 45.47,17.83 45.47,14.61 46.1,13.97 J1.5 56.31,13.97 56.44,14.1 56.44,14.35 56.31,14.48 55.12,14.48 54.99,14.61 54.99,14.86 55.12,14.99 56.31,14.99 56.44,15.11 56.44,15.37 56.31,15.49 55.12,15.49 54.99,15.62 54.99,15.88 55.12,16 56.31,16 56.44,16.13 56.44,16.38 56.31,16.51 55.12,16.51 54.99,16.64 54.99,16.89 55.12,17.02 56.31,17.02 56.44,17.14 56.44,17.4 56.31,17.53 55.12,17.53 54.99,17.65 54.99,17.91 55.12,18.03 56.31,18.03 56.44,18.16 56.44,18.41 56.31,18.54 55.12,18.54 54.99,18.67 54.99,18.92 55.12,19.05 56.31,19.05 56.44,19.18 56.44,19.43 56.31,19.56 55.12,19.56 54.99,19.68 54.99,19.94 55.12,20.07 56.31,20.07 56.44,20.19 56.44,20.45 56.31,20.57 55.12,20.57 54.99,20.7 54.99,20.95 55.12,21.08 56.31,21.08 56.44,21.21 56.44,21.46 56.31,21.59 55.12,21.59 54.99,21.72 54.99,21.97 55.12,22.1 56.31,22.1 56.44,22.23 56.44,22.48 56.31,22.61 55.12,22.61 54.99,22.73 54.99,22.99 55.12,23.11 56.31,23.11 56.44,23.24 56.44,23.5 56.31,23.62 55.12,23.62 54.99,23.75 54.99,24 55.12,24.13 56.36,24.13 56.49,24.26 56.49,24.51 56.36,24.64 55.05,24.64 54.93,24.77 54.93,25.02 55.05,25.15 56.31,25.15 56.44,25.27 56.44,25.53 56.31,25.65 53.47,25.65 53.34,25.78 53.34,30.23 53.62,30.51 U2.6
SPDLED
  Top 0.203: U5.4 37.32,24.4 35.76,25.96 35.76,28.85 30.57,34.04 27.43,34.04 26.82,34.65 26.82,41.66 22.96,45.52 12.61,45.52 J8.11
TCS  (via drill 0.3 pad 0.64)
  Top 0.203: U2.1 55.02,27.21 v54.99,27.18 | U2.11 v51.69,29.21 52.07,28.83 52.07,17.78 51.56,17.27 J1.2
  Bottom 0.203: v51.69,29.21 51.69,27.69 52.2,27.18 v54.99,27.18
TFSS  (via drill 0.3 pad 0.64)
  Top 0.254: v46.99,30.99 R13.1
  Bottom 0.254: v46.99,30.99 48.32,32.32 48.39,32.38 53.34,37.34 U1.5
TMISO
  Top 0.203: 50.25,11.68 J1.7 51.22,11.77 51.81,11.77 51.94,11.9 51.94,13.34 52.07,13.46 52.32,13.46 52.45,13.34 52.45,12.19 52.58,12.06 52.83,12.06 52.96,12.19 52.96,13.26 53.09,13.39 53.34,13.39 53.47,13.26 53.47,12.19 53.59,12.06 53.85,12.06 53.98,12.19 53.98,13.21 54.1,13.34 54.36,13.34 54.48,13.21 54.48,12.19 54.61,12.06 54.86,12.06 54.99,12.19 54.99,13.21 55.12,13.34 55.37,13.34 55.5,13.21 55.5,12.19 55.63,12.06 55.88,12.06 56.01,12.19 56.01,13.21 56.13,13.34 56.39,13.34 56.52,13.21 56.52,12.14 56.64,12.01 57.01,12.01 57.15,12.16 57.15,25.53 56.52,26.16 54.1,26.16 53.98,26.29 53.98,27.69 54.2,27.91 U2.2
TX+
  Top 0.254: U4.1 24.77,37.47 21.86,34.56 21.83,34.53 J8.1
TX-
  Top 0.254: U4.3 22.23,37.24 20.55,35.56 19.81,35.56 19.68,35.69 19.68,36.45 19.56,36.58 19.18,36.58 19.05,36.45 19.05,35.69 18.93,35.57 18.91,35.55 J8.2
TXON
  Top 0.203: U5.18 30.98,20.44 30.59,20.05 30.59,17.41 30.05,16.87 26.64,16.87 22.58,20.93 22.58,21.63 21.13,23.08 21.13,26.98 R21.1
  Top 0.406: U4.14 22.23,28.07 R21.1
TXOP
  Top 0.203: U5.17 30.87,20.94 30.19,20.26 30.19,17.61 29.84,17.27 26.84,17.27 23.03,21.09 23.03,21.6 25.2,23.77 25.94,24.52 25.94,26.89 R20.2
  Top 0.406: U4.16 24.77,28.07 R20.2
W!INT  (via drill 0.3 pad 0.64)
  Top 0.203: U5.40 39.98,18.94 42.16,16.76 43.69,16.76 v44.45,17.53
  Top 0.254: v34.92,40.64 35.56,40.01 36.56,40.01 U6.5
  Bottom 0.254: v44.45,17.53 44.32,17.65 44.32,35.31 39.62,40.01 35.56,40.01 v34.92,40.64
WCS  (via drill 0.3 pad 0.64)
  Top 0.203: U5.41 40.12,19.44 42.04,17.53 v43.18,17.53
  Top 0.254: U6.11 v32.38,39.37 32.38,39.88 32.24,40.02 U6.10
  Bottom 0.254: v32.38,39.37 39.37,39.37 43.81,34.92 43.81,18.16 v43.18,17.53
WMISO
  Top 0.203: U5.44 40.52,20.94 42.25,19.21 45.25,19.21 46.35,20.32 46.35,26.04 45.72,26.67 45.72,31.75 42.16,35.31 34.54,35.31 33.15,36.7 33.15,40.26 32.74,40.67 U6.9
WRST  (via drill 0.3 pad 0.64)
  Top 0.203: R2.1 43.18,21.46 42.04,21.46 41.38,22.12 v40.77,22.12 40.59,21.94 U5.46
  Top 0.305: D3.+ 21.72,5.71 26.04,10.03 39.75,10.03 v40.77,11.05
  Bottom 0.305: v40.77,11.05 v40.77,22.12
WSS
  Top 0.254: U1.11 36.58,49.28 29.72,42.42 R15.1

### Text on the board
tPlace: AJ2 | AJ1 | SCL | RX | SDA | TX | 5V | 5V | GND | GND | AJ3 | AJ5 | AJ4
bPlace: W5200 Ethernet Shield | v2.0 08/22/2012 | by Seeed Studio | www.seeedstudio.com